# Altium schematic sheet Main+Schematic.schdoc
size 800 x 440 mm
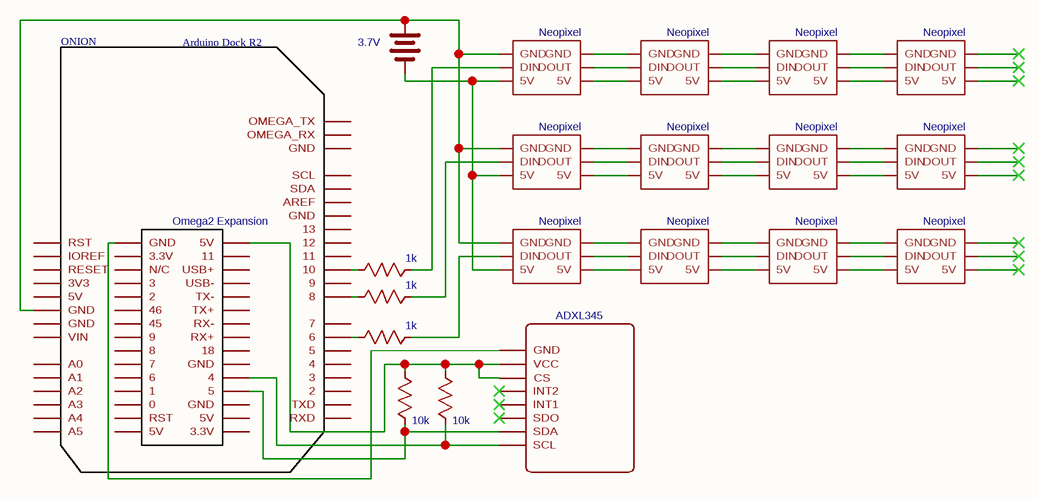
[diagram p0: Main+Schematic.schdoc]

## Parts
(Parts that share a designator on the sheet are numbered #1, #2 ... from top to bottom, then left to right.)
ONION#1  value Arduino Dock R2  [Main]
ONION#2  value Omega2 Expansion  [Main]
OSEPP  value ADXL345  [Main]
R1  value 1k  [AXIAL-0.3]
R2  value 1k  [AXIAL-0.3]
R3  (no value)  [AXIAL-0.3]
R4  value 1k  [AXIAL-0.3]
R5  (no value)  [AXIAL-0.3]
U1  value Neopixel  [APA102_5050]
U2  value Neopixel  [APA102_5050]
U3  value Neopixel  [APA102_5050]
U4  value Neopixel  [APA102_5050]
U5  value Neopixel  [APA102_5050]
U6  value Neopixel  [APA102_5050]
U7  value Neopixel  [APA102_5050]
U8  value Neopixel  [APA102_5050]
U13  value Neopixel  [APA102_5050]
U14  value Neopixel  [APA102_5050]
U15  value Neopixel  [APA102_5050]
U16  value Neopixel  [APA102_5050]
V1  value 3.7V  [BATTERY-1]

## Nets
NetONION#1_11: ONION#1.11(10) R4.1
NetONION#1_13: ONION#1.13(8) R2.1
NetONION#1_15: ONION#1.15(6) R1.1
NetONION#1_30: ONION#1.30(GND) U2.4(GND) U5.4(GND) U13.4(GND) V1.1
NetONION#2_1: ONION#2.1(GND) OSEPP.1(GND)
NetONION#2_21: ONION#2.21(5) ONION#2.22(4) OSEPP.7(SDA) OSEPP.8(SCL) R3.1 R5.1
NetONION#2_32: ONION#2.32(5V) OSEPP.2(VCC) OSEPP.3(CS) R3.2 R5.2
NetR1_2: R1.2 U2.5(DIN)
NetR2_2: R2.2 U5.5(DIN)
NetR4_2: R4.2 U13.5(DIN)
NetU1_1: U1.1(5V) U3.6(5V)
NetU1_2: U1.2(DOUT) U3.5(DIN)
NetU1_3: U1.3(GND) U3.4(GND)
NetU1_4: U1.4(GND) U2.3(GND)
NetU1_5: U1.5(DIN) U2.2(DOUT)
NetU1_6: U1.6(5V) U2.1(5V)
NetU2_6: U2.6(5V) U5.6(5V) U13.6(5V) V1.2
NetU3_1: U3.1(5V) U4.6(5V)
NetU3_2: U3.2(DOUT) U4.5(DIN)
NetU3_3: U3.3(GND) U4.4(GND)
NetU5_1: U5.1(5V) U6.6(5V)
NetU5_2: U5.2(DOUT) U6.5(DIN)
NetU5_3: U5.3(GND) U6.4(GND)
NetU6_1: U6.1(5V) U7.6(5V)
NetU6_2: U6.2(DOUT) U7.5(DIN)
NetU6_3: U6.3(GND) U7.4(GND)
NetU7_1: U7.1(5V) U8.6(5V)
NetU7_2: U7.2(DOUT) U8.5(DIN)
NetU7_3: U7.3(GND) U8.4(GND)
NetU13_1: U13.1(5V) U14.6(5V)
NetU13_2: U13.2(DOUT) U14.5(DIN)
NetU13_3: U13.3(GND) U14.4(GND)
NetU14_1: U14.1(5V) U15.6(5V)
NetU14_2: U14.2(DOUT) U15.5(DIN)
NetU14_3: U14.3(GND) U15.4(GND)
NetU15_1: U15.1(5V) U16.6(5V)
NetU15_2: U15.2(DOUT) U16.5(DIN)
NetU15_3: U15.3(GND) U16.4(GND)

Not connected (* = marked no-connect by the designer): ONION#1 1(OMEGA_TX) 2(OMEGA_RX) 3(GND) 4(SCL) 5(SDA) 6(AREF) 7(GND) 8(13) 9(12) 10(11) 12(9) 14(7) 16(5) 17(4) 18(3) 19(2) 20(TXD) 21(RXD) 22(A5) 23(A4) 24(A3) 25(A2) 26(A1) 27(A0) 28(VIN) 29(GND) 31(5V) 32(3V3) 33(RESET) 34(IOREF) 35(RST); ONION#2 2(3.3V) 3(N/C) 4(3) 5(2) 6(46) 7(45) 8(9) 9(8) 10(7) 11(6) 12(1) 13(0) 14(RST) 15(5V) 18(3.3V) 19(5V) 20(GND) 23(GND) 24(18) 25(RX+) 26(RX-) 27(TX+) 28(TX-) 29(USB-) 30(USB+) 31(11); OSEPP 4(INT2)* 5(INT1)* 6(SDO)*; U4 1(5V)* 2(DOUT)* 3(GND)*; U8 1(5V)* 2(DOUT)* 3(GND)*; U16 1(5V)* 2(DOUT)* 3(GND)*

## Notes on the sheet
- (near R5) 10k
- (near R3) 10k

## Library data of the parts
R1 R2 R4 = (no symbol name): nameAlias: Value(Ω); BOM_Manufacturer Part: ?; spicePre: R; spiceSymbolName: Resistor
R3 R5 = (no symbol name): nameAlias: Value(Ω); Value: NO; BOM_Manufacturer Part: ?; spicePre: R; spiceSymbolName: Resistor
U1-U8 U13-U16 = (no symbol name): catid: 20; description: APA102C 5050 RGB LED; BOM_Mounted: No; BOM_Manufacturer Part: ?; spicePre: U
V1 = (no symbol name): nameAlias: Value; BOM_Manufacturer Part: ?; spicePre: V; spiceSymbolName: Battery